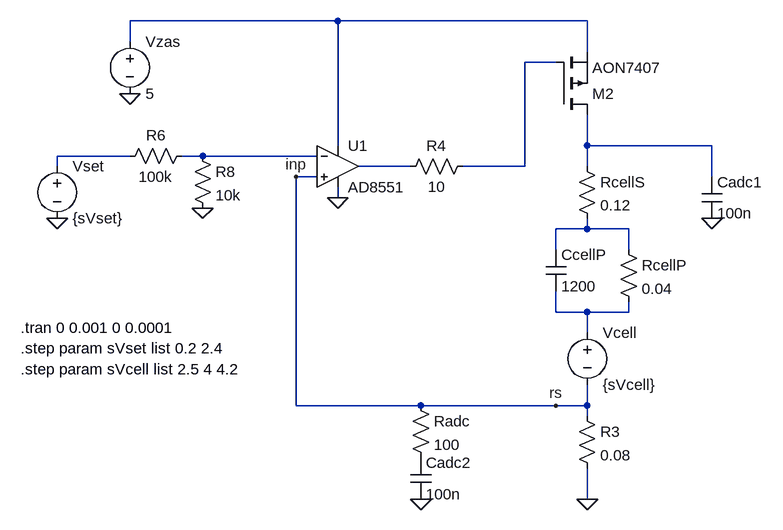
[diagram p0: schematic oldmodel.asc]
oldmodel.asc, the LTspice schematic file:
Version 4
SHEET 1 880 816
WIRE 48 16 -272 16
WIRE 432 16 48 16
WIRE -272 48 -272 16
WIRE 432 64 432 16
WIRE 384 80 336 80
WIRE 48 208 48 16
WIRE 432 208 432 160
WIRE 624 208 432 208
WIRE -272 224 -384 224
WIRE -160 224 -192 224
WIRE 16 224 -160 224
WIRE -384 240 -384 224
WIRE 160 240 80 240
WIRE 336 240 336 80
WIRE 336 240 240 240
WIRE 432 240 432 208
WIRE 16 256 -16 256
WIRE 624 256 624 208
WIRE 48 288 48 272
WIRE 432 336 432 320
WIRE 432 336 384 336
WIRE 496 336 432 336
WIRE 384 368 384 336
WIRE 496 368 496 336
WIRE 384 464 384 432
WIRE 432 464 384 464
WIRE 496 464 496 448
WIRE 496 464 432 464
WIRE 432 496 432 464
WIRE -16 608 -16 256
WIRE 176 608 -16 608
WIRE 384 608 176 608
WIRE 432 608 432 576
WIRE 432 608 384 608
WIRE 432 624 432 608
WIRE 432 752 432 704
FLAG 432 752 0
FLAG 48 288 0
FLAG -272 128 0
FLAG -384 320 0
FLAG 384 608 rs
FLAG -16 256 inp
FLAG 176 752 0
FLAG -160 304 0
FLAG 624 320 0
SYMBOL voltage -384 224 R0
WINDOW 123 0 0 Left 0
WINDOW 39 0 0 Left 0
SYMATTR InstName Vset
SYMATTR Value {sVset}
SYMBOL voltage -272 32 R0
WINDOW 123 0 0 Left 0
WINDOW 39 0 0 Left 0
SYMATTR InstName Vzas
SYMATTR Value 5
SYMBOL pmos 384 160 M180
SYMATTR InstName M2
SYMATTR Value AON7407
SYMBOL Opamps\\AD8551 48 176 R0
SYMATTR InstName U1
SYMBOL res 416 224 R0
SYMATTR InstName RcellS
SYMATTR Value 0.12
SYMBOL voltage 432 480 R0
WINDOW 123 0 0 Left 0
WINDOW 39 0 0 Left 0
SYMATTR InstName Vcell
SYMATTR Value {sVcell}
SYMBOL res 480 352 R0
SYMATTR InstName RcellP
SYMATTR Value 0.04
SYMBOL cap 368 368 R0
SYMATTR InstName CcellP
SYMATTR Value 1200
SYMBOL res 416 608 R0
SYMATTR InstName R3
SYMATTR Value 0.08
SYMATTR SpiceLine tol=1 pwr=3
SYMBOL res 256 224 R90
WINDOW 0 0 56 VBottom 2
WINDOW 3 32 56 VTop 2
SYMATTR InstName R4
SYMATTR Value 10
SYMBOL res 160 592 R0
SYMATTR InstName Radc
SYMATTR Value 100
SYMBOL cap 160 688 R0
SYMATTR InstName Cadc2
SYMATTR Value 100n
SYMBOL res -176 208 R90
WINDOW 0 0 56 VBottom 2
WINDOW 3 32 56 VTop 2
SYMATTR InstName R6
SYMATTR Value 100k
SYMBOL res -176 208 R0
SYMATTR InstName R8
SYMATTR Value 10k
SYMBOL cap 608 256 R0
SYMATTR InstName Cadc1
SYMATTR Value 100n
TEXT -440 488 Left 2 !.tran 0 0.001 0 0.0001
TEXT -440 520 Left 2 !.step param sVset list 0.2 2.4
TEXT -440 552 Left 2 !.step param sVcell list 2.5 4 4.2

The netlist it stands for:
* oldmodel.asc
Vset N004 0 {sVset}
Vzas N001 0 5
M2 N003 N002 N001 N001 AON7407
XU1 inp N005 N001 0 N006 AD8551  ; pins In+ In- V+ V- OUT
RcellS N003 N007 0.12
Vcell N008 inp {sVcell}
RcellP N007 N008 0.04
CcellP N007 N008 1200
R3 inp 0 0.08 tol=1 pwr=3
R4 N002 N006 10
Radc inp P001 100
Cadc2 P001 0 100n
R6 N005 N004 100k
R8 N005 0 10k
Cadc1 N003 0 100n
.model NMOS NMOS
.model PMOS PMOS
.lib standard.mos
.tran 0 0.001 0 0.0001
.step param sVset list 0.2 2.4
.step param sVcell list 2.5 4 4.2
.backanno
.end